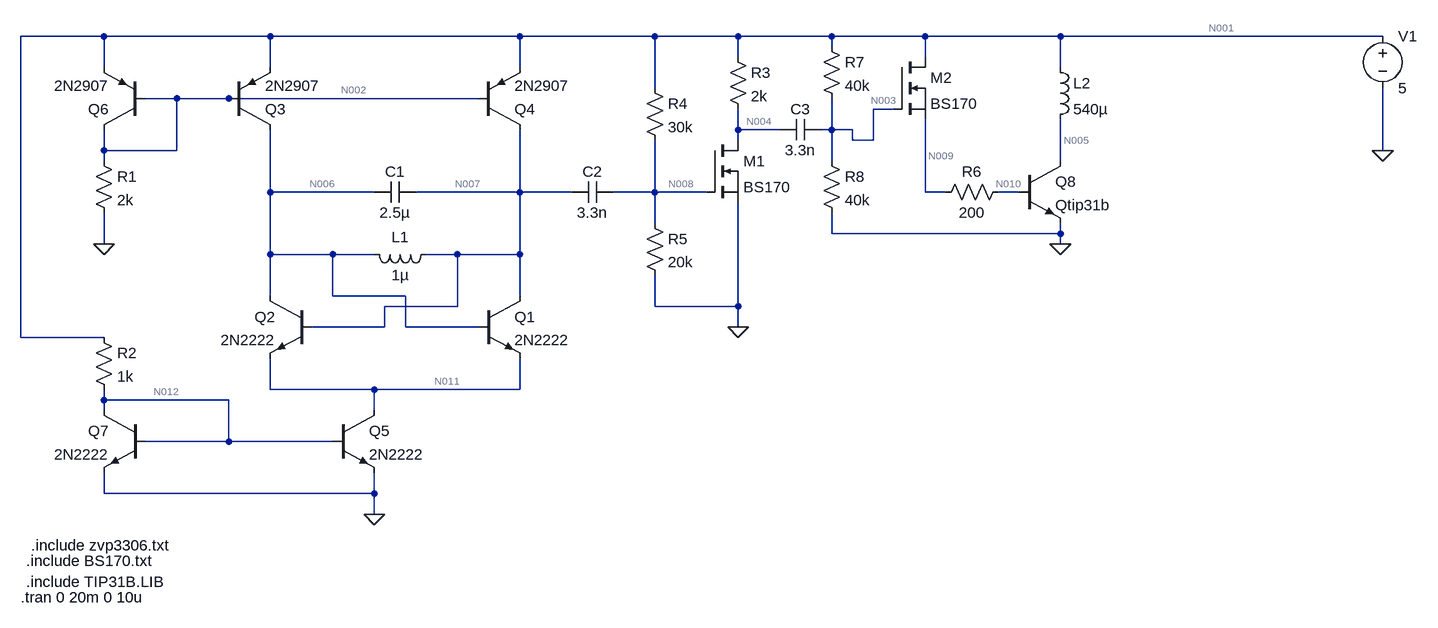
[diagram p0: schematic PowerTransmitter.asc]
PowerTransmitter.asc, the LTspice schematic file:
Version 4
SHEET 1 968 1384
WIRE -1056 496 -1184 496
WIRE -800 496 -1056 496
WIRE -416 496 -800 496
WIRE -208 496 -416 496
WIRE -80 496 -208 496
WIRE 64 496 -80 496
WIRE 208 496 64 496
WIRE 416 496 208 496
WIRE 912 496 416 496
WIRE 64 512 64 496
WIRE -80 528 -80 496
WIRE 208 528 208 496
WIRE -1056 544 -1056 496
WIRE -800 544 -800 496
WIRE -416 544 -416 496
WIRE 416 544 416 496
WIRE -208 576 -208 496
WIRE -944 592 -992 592
WIRE -864 592 -944 592
WIRE -480 592 -864 592
WIRE 160 608 128 608
WIRE -80 640 -80 608
WIRE -16 640 -80 640
WIRE 64 640 64 592
WIRE 64 640 48 640
WIRE 96 640 64 640
WIRE -80 656 -80 640
WIRE 96 656 96 640
WIRE 128 656 128 608
WIRE 128 656 96 656
WIRE -1056 672 -1056 640
WIRE -944 672 -944 592
WIRE -944 672 -1056 672
WIRE 912 672 912 576
WIRE -1056 688 -1056 672
WIRE 64 688 64 640
WIRE 416 688 416 624
WIRE -800 736 -800 640
WIRE -640 736 -800 736
WIRE -416 736 -416 640
WIRE -416 736 -576 736
WIRE -336 736 -416 736
WIRE -208 736 -208 656
WIRE -208 736 -272 736
WIRE -128 736 -208 736
WIRE 208 736 208 624
WIRE 240 736 208 736
WIRE 352 736 320 736
WIRE -208 784 -208 736
WIRE 64 800 64 768
WIRE 416 800 416 784
WIRE 416 800 64 800
WIRE -1056 816 -1056 768
WIRE 416 816 416 800
WIRE -800 832 -800 736
WIRE -704 832 -800 832
WIRE -640 832 -704 832
WIRE -512 832 -560 832
WIRE -416 832 -416 736
WIRE -416 832 -512 832
WIRE -800 896 -800 832
WIRE -704 896 -704 832
WIRE -592 896 -704 896
WIRE -416 896 -416 832
WIRE -512 912 -512 832
WIRE -512 912 -624 912
WIRE -208 912 -208 864
WIRE -80 912 -80 752
WIRE -80 912 -208 912
WIRE -624 944 -624 912
WIRE -624 944 -736 944
WIRE -592 944 -592 896
WIRE -480 944 -592 944
WIRE -80 944 -80 912
WIRE -1184 960 -1184 496
WIRE -1056 960 -1184 960
WIRE -800 1040 -800 992
WIRE -640 1040 -800 1040
WIRE -416 1040 -416 992
WIRE -416 1040 -640 1040
WIRE -1056 1056 -1056 1040
WIRE -864 1056 -1056 1056
WIRE -1056 1072 -1056 1056
WIRE -640 1072 -640 1040
WIRE -864 1120 -864 1056
WIRE -864 1120 -992 1120
WIRE -704 1120 -864 1120
WIRE -1056 1200 -1056 1168
WIRE -640 1200 -640 1168
WIRE -640 1200 -1056 1200
WIRE -640 1232 -640 1200
FLAG 912 672 0
FLAG -640 1232 0
FLAG -1056 816 0
FLAG -80 944 0
FLAG 416 816 0
SYMBOL ind -544 816 R90
WINDOW 0 5 56 VBottom 2
WINDOW 3 32 56 VTop 2
SYMATTR InstName L1
SYMATTR Value 1µ
SYMBOL cap -576 720 R90
WINDOW 0 0 32 VBottom 2
WINDOW 3 32 32 VTop 2
SYMATTR InstName C1
SYMATTR Value 2.5µ
SYMBOL voltage 912 480 R0
WINDOW 123 0 0 Left 0
WINDOW 39 0 0 Left 0
SYMATTR InstName V1
SYMATTR Value 5
SYMBOL npn -480 896 R0
SYMATTR InstName Q1
SYMATTR Value 2N2222
SYMBOL npn -736 896 M0
SYMATTR InstName Q2
SYMATTR Value 2N2222
SYMBOL pnp -864 640 M180
SYMATTR InstName Q3
SYMATTR Value 2N2907
SYMBOL pnp -480 640 M180
SYMATTR InstName Q4
SYMATTR Value 2N2907
SYMBOL npn -704 1072 R0
SYMATTR InstName Q5
SYMATTR Value 2N2222
SYMBOL pnp -992 640 R180
SYMATTR InstName Q6
SYMATTR Value 2N2907
SYMBOL res -1072 672 R0
SYMATTR InstName R1
SYMATTR Value 2k
SYMBOL npn -992 1072 M0
SYMATTR InstName Q7
SYMATTR Value 2N2222
SYMBOL res -1072 944 R0
SYMATTR InstName R2
SYMATTR Value 1k
SYMBOL nmos -128 656 R0
SYMATTR InstName M1
SYMATTR Value BS170
SYMBOL res -96 512 R0
SYMATTR InstName R3
SYMATTR Value 2k
SYMBOL res -224 560 R0
SYMATTR InstName R4
SYMATTR Value 30k
SYMBOL res -224 768 R0
SYMATTR InstName R5
SYMATTR Value 20k
SYMBOL cap -272 720 R90
WINDOW 0 0 32 VBottom 2
WINDOW 3 32 32 VTop 2
SYMATTR InstName C2
SYMATTR Value 3.3n
SYMBOL npn 352 688 R0
SYMATTR InstName Q8
SYMATTR Value Qtip31b
SYMBOL ind 400 528 R0
SYMATTR InstName L2
SYMATTR Value 540µ
SYMATTR SpiceLine Rser=10
SYMBOL res 336 720 R90
WINDOW 0 0 56 VBottom 2
WINDOW 3 32 56 VTop 2
SYMATTR InstName R6
SYMATTR Value 200
SYMBOL cap 48 624 R90
WINDOW 0 0 32 VBottom 2
WINDOW 3 32 32 VTop 2
SYMATTR InstName C3
SYMATTR Value 3.3n
SYMBOL res 48 496 R0
SYMATTR InstName R7
SYMATTR Value 40k
SYMBOL res 48 672 R0
SYMATTR InstName R8
SYMATTR Value 40k
SYMBOL nmos 160 528 R0
SYMATTR InstName M2
SYMATTR Value BS170
TEXT -1176 1304 Left 2 !.include BS170.txt
TEXT -1176 1336 Left 2 !.include TIP31B.LIB
TEXT -1184 1360 Left 2 !.tran 0 20m 0 10u
TEXT -1168 1280 Left 2 !.include zvp3306.txt

The netlist it stands for:
* PowerTransmitter.asc
L1 N007 N006 1µ
C1 N007 N006 2.5µ
V1 N001 0 5
Q1 N007 N006 N011 0 2N2222
Q2 N006 N007 N011 0 2N2222
Q3 N006 N002 N001 0 2N2907
Q4 N007 N002 N001 0 2N2907
Q5 N011 N012 0 0 2N2222
Q6 N002 N002 N001 0 2N2907
R1 N002 0 2k
Q7 N012 N012 0 0 2N2222
R2 N001 N012 1k
M1 N004 N008 0 0 BS170
R3 N001 N004 2k
R4 N001 N008 30k
R5 N008 0 20k
C2 N008 N007 3.3n
Q8 N005 N010 0 0 Qtip31b
L2 N001 N005 540µ Rser=10
R6 N010 N009 200
C3 N003 N004 3.3n
R7 N001 N003 40k
R8 N003 0 40k
M2 N001 N003 N009 N009 BS170
.model NPN NPN
.model PNP PNP
.lib standard.bjt
.model NMOS NMOS
.model PMOS PMOS
.lib standard.mos
.include BS170.txt
.include TIP31B.LIB
.tran 0 20m 0 10u
.include zvp3306.txt
.backanno
.end

* Results of the author's LTspice run, read from the files saved beside the schematic
* Operating Point, zero values left out:
*   V(n007) = 2.86 V
*   V(n006) = 2.86 V
*   V(n001) = 5 V
*   V(n011) = 2.184 V
*   V(n002) = 4.325 V
*   V(n012) = 694.1 mV
*   V(n004) = 1.306 V
*   V(n008) = 2 V
*   V(n005) = 4.516 V
*   V(n010) = 580.7 mV
*   V(n009) = 619.6 mV
*   V(n003) = 2.5 V
*   Ic(Q8) = 48.43 mA
*   Ib(Q8) = 194.2 µA
*   Ie(Q8) = -48.63 mA
*   Ic(Q6) = -2.136 mA
*   Ib(Q6) = -8.607 µA
*   Ie(Q6) = 2.145 mA
*   Ic(Q4) = -2.162 mA
*   Ib(Q4) = -8.605 µA
*   Ie(Q4) = 2.171 mA
*   Ic(Q3) = -2.162 mA
*   Ib(Q3) = -8.605 µA
*   Ie(Q3) = 2.171 mA
*   Ic(Q7) = 4.263 mA
*   Ib(Q7) = 21.62 µA
*   Ie(Q7) = -4.284 mA
*   Ic(Q5) = 4.324 mA
*   Ib(Q5) = 21.61 µA
*   Ie(Q5) = -4.346 mA
*   Ic(Q2) = 2.151 mA
*   Ib(Q2) = 10.83 µA
*   Ie(Q2) = -2.162 mA
*   Ic(Q1) = 2.151 mA
*   Ib(Q1) = 10.83 µA
*   Ie(Q1) = -2.162 mA
*   Id(M2) = 194.2 µA
*   Is(M2) = -194.2 µA
*   Id(M1) = 1.847 mA
*   Is(M1) = -1.847 mA
*   I(L2) = 48.43 mA
*   I(R8) = 62.5 µA
*   I(R7) = 62.5 µA
*   I(R6) = -194.2 µA
*   I(R5) = 100 µA
*   I(R4) = 100 µA
*   I(R3) = 1.847 mA
*   I(R2) = 4.306 mA
*   I(R1) = 2.162 mA
*   I(V1) = -61.43 mA